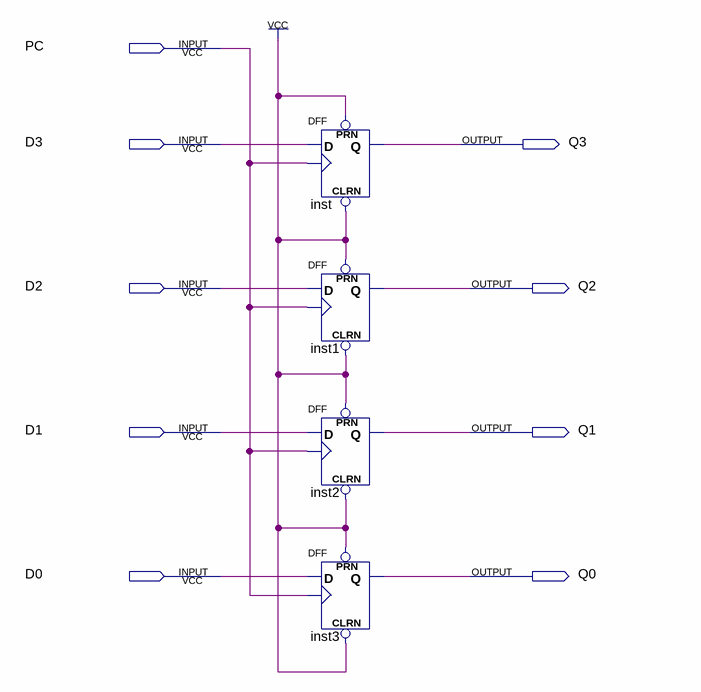
[diagram p0: schematic sheet]
// Quartus schematic register-4.bdf as structural Verilog: 4 symbols, 9 pins
module \register-4  (
  input  PC,
  input  D3,
  input  D2,
  input  D1,
  input  D0,
  output Q3,
  output Q2,
  output Q1,
  output Q0
);

  DFF inst (.CLRN(1'b1), .CLK(PC), .D(D3), .PRN(1'b1), .Q(Q3));
  DFF inst1 (.CLRN(1'b1), .CLK(PC), .D(D2), .PRN(1'b1), .Q(Q2));
  DFF inst2 (.CLRN(1'b1), .CLK(PC), .D(D1), .PRN(1'b1), .Q(Q1));
  DFF inst3 (.CLRN(1'b1), .CLK(PC), .D(D0), .PRN(1'b1), .Q(Q0));
endmodule
